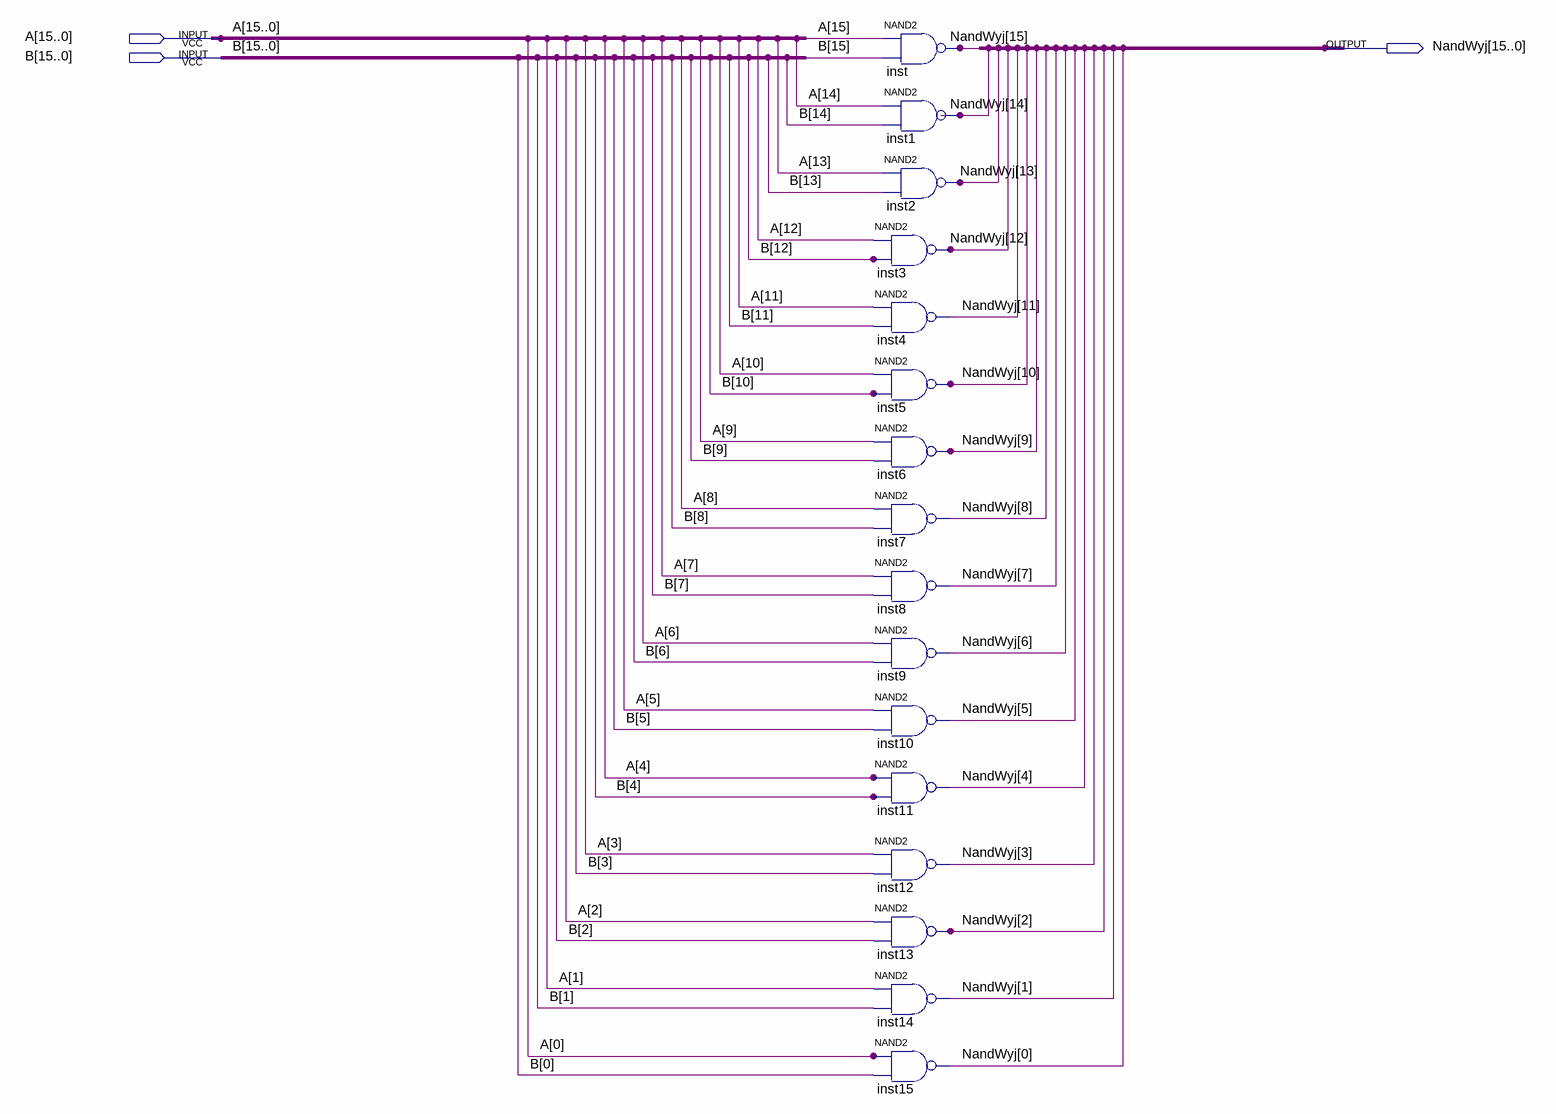
[diagram p0: schematic sheet]
// Quartus schematic nandvector.bdf as structural Verilog: 16 symbols, 3 pins
module nandvector (
  input  [15:0] A,
  input  [15:0] B,
  output [15:0] NandWyj
);

  nand inst (NandWyj[15], A[15], B[15]);
  nand inst1 (NandWyj[14], A[14], B[14]);
  nand inst2 (NandWyj[13], A[13], B[13]);
  nand inst3 (NandWyj[12], A[12], B[12]);
  nand inst4 (NandWyj[11], A[11], B[11]);
  nand inst5 (NandWyj[10], A[10], B[10]);
  nand inst6 (NandWyj[9], A[9], B[9]);
  nand inst7 (NandWyj[8], A[8], B[8]);
  nand inst8 (NandWyj[7], A[7], B[7]);
  nand inst9 (NandWyj[6], A[6], B[6]);
  nand inst10 (NandWyj[5], A[5], B[5]);
  nand inst11 (NandWyj[4], A[4], B[4]);
  nand inst12 (NandWyj[3], A[3], B[3]);
  nand inst13 (NandWyj[2], A[2], B[2]);
  nand inst14 (NandWyj[1], A[1], B[1]);
  nand inst15 (NandWyj[0], A[0], B[0]);
endmodule
